# EAGLE board PSU (EAGLE 9.6.2)
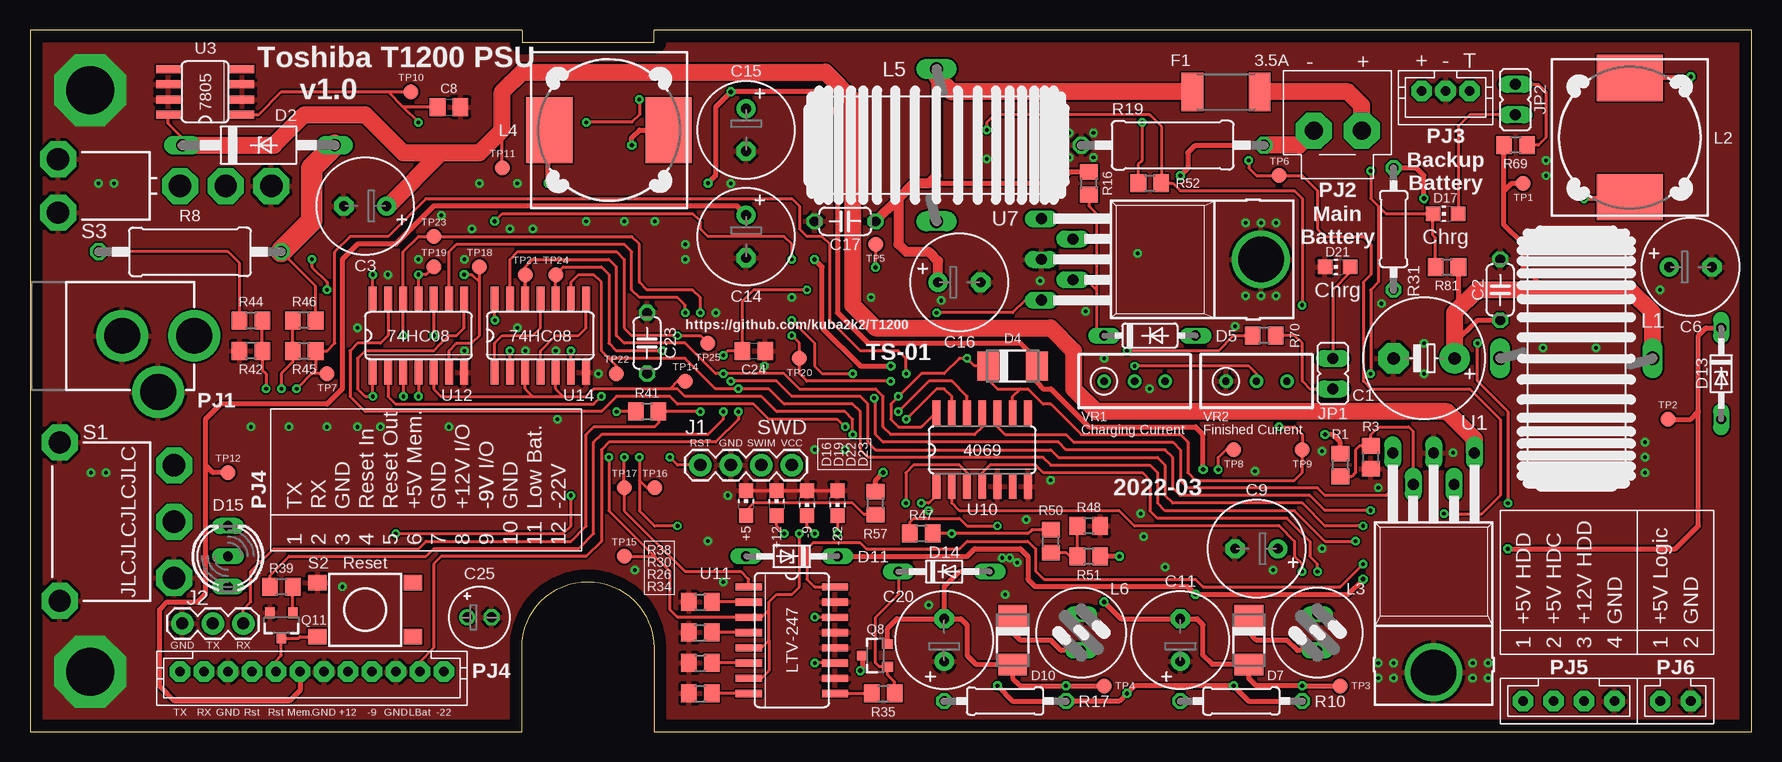
[diagram p2: board, top side]
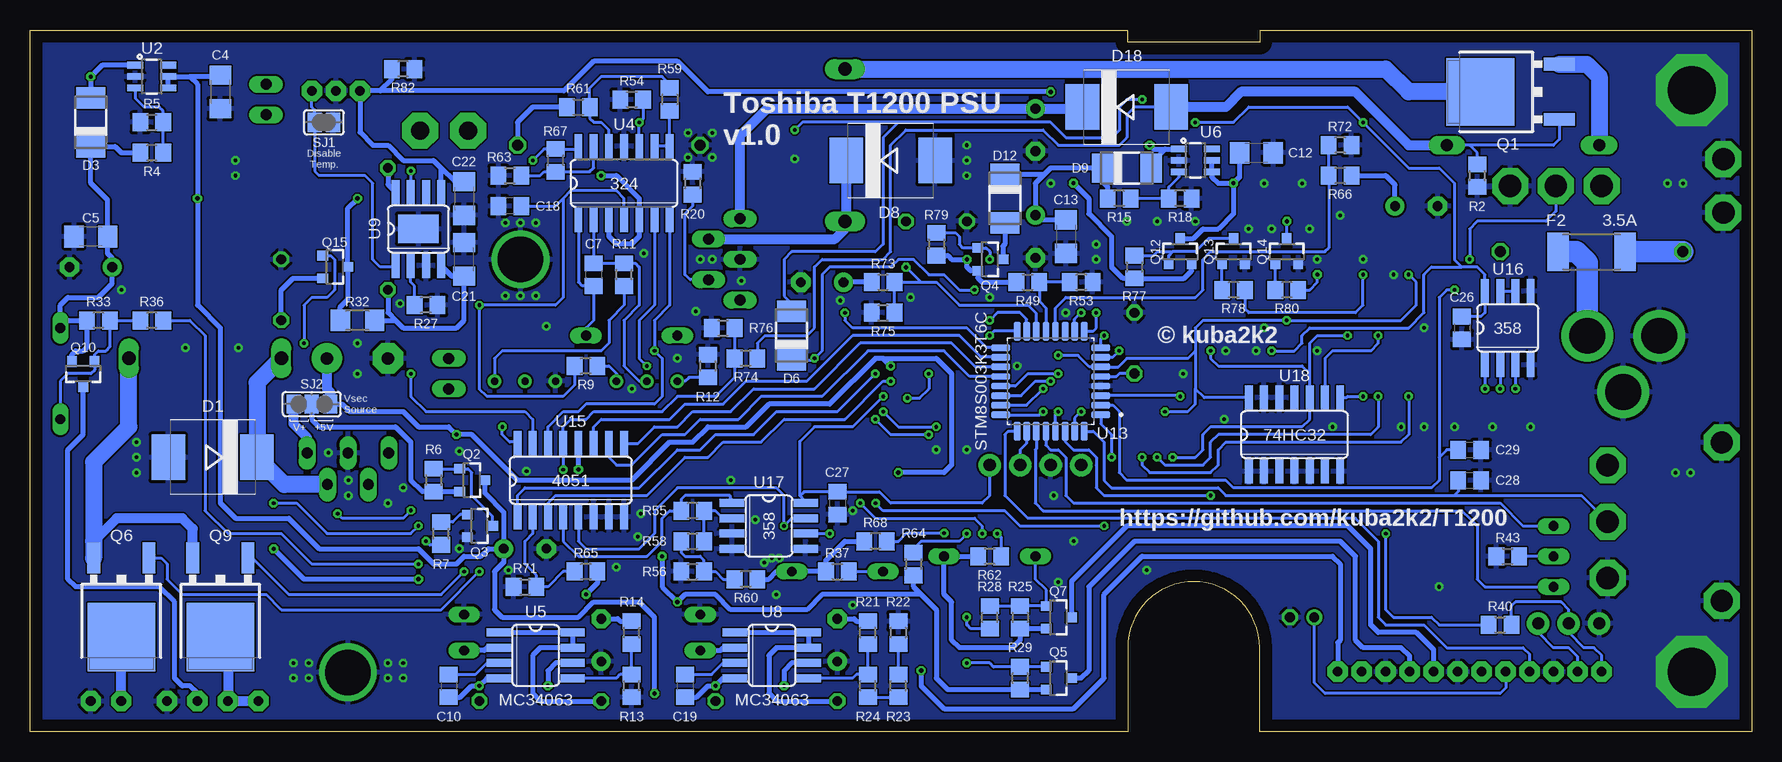
[diagram p3: board, bottom side, seen from below]

Size 143.5 x 58.5 mm. Coordinates in mm from the lower left corner, seen from the top.
Outline: 143.5,0 143.5,58.5 52,58.5 52,57.5 41,57.5 41,58.5 0,58.5 0,0 41,0 41,7 arc-180 52,7 52,0 143.5,0
Copper layers (1*16): Top 0.035mm / dielectric 1.5mm / Bottom 0.035mm
Design rules "default *": minimum track width 6mil, minimum drill 0.3mm, track to track 6mil, track to pad 6mil, pad to pad 6mil, via to via 6mil, smd to smd 6mil, copper to edge 40mil, drill to drill 6mil, minimum pad ring 10mil, minimum via ring 8mil, stop-mask expansion 4mil, vias tented up to drill 16mil, thermal gap 10mil
Net classes: 1 0.1A: width 0.254 mm, drill 0.25 mm; 2 1.2A: width 0.406 mm, drill 0.35 mm; 3 2A: width 0.813 mm, drill 0.8 mm; 4 3A: width 1.422 mm; 5 3.5A: width 1.778 mm; 6 min 1.2A: width 0.406 mm, drill 0.35 mm

## Footprints (pad centres in the part's own frame; a part is rotated, then mirrored left to right if it is on the bottom)
E5-10,5 = drill 1.016 pad 2.54: + -2.54,0 | drill 1.016 pad 2.54 octagon: - 2.54,0
C050-024X044 = drill 0.813 octagon: 1 -2.54,0; 2 2.54,0
E3,5-8 = drill 0.813 pad 1.6: + -1.778,0 | drill 0.813 pad 1.6 octagon: - 1.778,0
C1206 = smd 1.6 x 1.8: 1 -1.4,0; 2 1.4,0
C0805 = smd 1.3 x 1.5: 1 -0.95,0; 2 0.95,0
E2-5 = drill 0.813 pad 1.27: + -1.016,0 | drill 0.813 pad 1.27 octagon: - 1.016,0
SMC = smd 2.8 x 3.8: A 3.7,0; C -3.7,0
F126Z12 = drill 1.016 long: A 6.35,0; C -6.35,0
DO-214AC = smd 1.8 x 2.4: A 2.025,0; C -2.025,0
DO35-7 = drill 0.813 long: A 3.81,0; C -3.81,0
DO34Z7 = drill 0.813 long: A 3.81,0; C -3.81,0
DUOLED-C-5MM = drill 0.813 long: AR 2.54,0; AX -2.54,0; C 0,0
CHIP-LED0805 = smd 1.2 x 1.2: A 0,-1.05; C 0,1.05
2512 = smd 1.8 x 3.2: 1 -2.8,0; 2 2.8,0
1X04 = drill 1.016 pad 1.88: 1 0,0; 2 2.54,0; 3 5.08,0; 4 7.62,0
1X03 = drill 1.016 pad 1.88: 1 0,0; 2 2.54,0; 3 5.08,0
JP1 = drill 0.914 long: 1 0,-1.27; 2 0,1.27
SFT1030 = drill 1.118 long: 1 -6.35,0; 2 6.35,0
DR127 = smd 3.85 x 5.5: 1 -4.975,0; 2 4.975,0
COIL0608 = drill 0.813 long: 1 0,1.5; 2 0,-1.5
POWER_JACK_PTH = drill 2.997 pad 4.318: GND 0,7.7; GNDBREAK 4.7,10.7; PWR 0,13.7
JST-PH2-4.00 = drill 1.5 pad 3 octagon: 1 2,0; 2 -2,0
JST-PH3 = drill 0.813 pad 1.676 octagon: 1 2,0; 2 0,0; 3 -2,0
JST-PH12 = drill 0.813 pad 1.676 octagon: 1 11,0; 2 9,0; 3 7,0; 4 5,0; 5 3,0; 6 1,0; 7 -1,0; 8 -3,0; 9 -5,0; 10 -7,0; 11 -9,0; 12 -11,0
JST-PH4-2.54 = drill 0.813 pad 1.676 octagon: 1 3.81,0; 2 1.27,0; 3 -1.27,0; 4 -3.81,0
JST-PH2-2.54 = drill 0.813 pad 1.676 octagon: 1 1.27,0; 2 -1.27,0
TO-252/DPAK = smd 1.06 x 2.6: 1 -2.3,-4.31; 3 2.3,-4.31 | smd 5.632 x 5.7: 2 0,2.288
SOT23-3 = smd 0.8 x 0.9: 1 -0.95,-1; 2 0.95,-1; 3 0,1.1
R0805 = smd 1.3 x 1.5: 1 -0.95,0; 2 0.95,0
0411/15 = drill 0.914 octagon: 1 -7.62,0; 2 7.62,0
0207/10 = drill 0.813 octagon: 1 -5.08,0; 2 5.08,0
R1206 = smd 1.6 x 1.803: 1 -1.422,0; 2 1.422,0
1101M2S3ABE2 = drill 1.85 pad 3 octagon: 1 0,-4.7; 2 0,0; 3 0,4.7; S1 -9.53,-6.605; S2 -9.53,6.605
TACTILE_SWITCH_SMD_6.2MM_TALL = smd 1.55 x 1.3: A1 -3.975,-2.25; A2 3.975,-2.25; B1 -3.975,2.25; B2 3.975,2.25
1101M2S3AV2BE2 = drill 1.85 pad 3 octagon: 1 0,0; 2 3.81,0; 3 7.62,0; S1 -10.16,-2.225; S2 -10.16,2.225
SJ = smd 1.168 x 1.6: 1 -0.762,0; 2 0.762,0
SJ_2 = smd 1.168 x 1.6: 1 -1.524,0; 2 0,0; 3 1.524,0
B1,27 = smd 1.27 x 1.27: TP 0,0
TO220-52-VIAHOLE = drill 0.9 long: 1 -3.4,-21.1; 2 -1.7,-18.47; 3 0,-21.1; 4 1.7,-18.47; 5 3.4,-21.1 | drill 3.8: TAB 0,-2.8
SOT23-6 = smd 0.55 x 1.35: 1 -0.95,-1.375; 2 0,-1.375; 3 0.95,-1.375; 4 0.95,1.375; 5 0,1.375; 6 -0.95,1.375
SO08 = smd 0.66 x 2.032: 1 -1.905,-3.073; 2 -0.635,-3.073; 3 0.635,-3.073; 4 1.905,-3.073; 5 1.905,3.073; 6 0.635,3.073; 7 -0.635,3.073; 8 -1.905,3.073
SO14 = smd 0.66 x 2.032: 1 -3.81,-3.073; 2 -2.54,-3.073; 3 -1.27,-3.073; 4 0,-3.073; 5 1.27,-3.073; 6 2.54,-3.073; 7 3.81,-3.073; 8 3.81,3.073; 9 2.54,3.073; 10 1.27,3.073; 11 0,3.073; 12 -1.27,3.073; 13 -2.54,3.073; 14 -3.81,3.073
SO08-PAD = smd 0.66 x 2.032: 1 -1.905,-3.073; 2 -0.635,-3.073; 3 0.635,-3.073; 4 1.905,-3.073; 5 1.905,3.073; 6 0.635,3.073; 7 -0.635,3.073; 8 -1.905,3.073 | smd 3.4 x 2.4: PAD 0,0
SO16-GULLWING = smd 0.6 x 2.2: 1 -4.445,-3.6; 2 -3.175,-3.6; 3 -1.905,-3.6; 4 -0.635,-3.6; 5 0.635,-3.6; 6 1.905,-3.6; 7 3.175,-3.6; 8 4.445,-3.6; 9 4.445,3.6; 10 3.175,3.6; 11 1.905,3.6; 12 0.635,3.6; 13 -0.635,3.6; 14 -1.905,3.6; 15 -3.175,3.6; 16 -4.445,3.6
QFP80P900X900X160-32N = smd 1.56 x 0.55: 1 -4.18,2.8; 2 -4.18,2; 3 -4.18,1.2; 4 -4.18,0.4; 5 -4.18,-0.4; 6 -4.18,-1.2; 7 -4.18,-2; 8 -4.18,-2.8; 17 4.18,-2.8; 18 4.18,-2; 19 4.18,-1.2; 20 4.18,-0.4; 21 4.18,0.4; 22 4.18,1.2; 23 4.18,2; 24 4.18,2.8 | smd 0.55 x 1.56: 9 -2.8,-4.18; 10 -2,-4.18; 11 -1.2,-4.18; 12 -0.4,-4.18; 13 0.4,-4.18; 14 1.2,-4.18; 15 2,-4.18; 16 2.8,-4.18; 25 2.8,4.18; 26 2,4.18; 27 1.2,4.18; 28 0.4,4.18; 29 -0.4,4.18; 30 -1.2,4.18; 31 -2,4.18; 32 -2.8,4.18
SO16 = smd 0.66 x 2.032: 1 -4.445,-3.073; 2 -3.175,-3.073; 3 -1.905,-3.073; 4 -0.635,-3.073; 5 0.635,-3.073; 6 1.905,-3.073; 7 3.175,-3.073; 8 4.445,-3.073; 9 4.445,3.073; 10 3.175,3.073; 11 1.905,3.073; 12 0.635,3.073; 13 -0.635,3.073; 14 -1.905,3.073; 15 -3.175,3.073; 16 -4.445,3.073
RTRIM3296W = drill 0.61: 1 0,-2.54; 2 0,0; 3 0,2.54

## Placement (x,y rotation side)
C1  1000u  [E5-10,5]  116.2,31.11 180 top
C2  1u  [C050-024X044]  122.56,36.83 90 top
C3  470u  [E3,5-8]  27.94,43.81 180 top
C4  10u  [C1206]  127.64,53.34 270 bottom
C5  10u  [C1206]  138.43,41.27 180 bottom
C6  100u  [E3,5-8]  138.43,38.73 0 top
C7  100n  [C0805]  96.52,38.1 270 bottom
C8  100n  [C0805]  34.92,52.07 0 top
C9  100u  [E3,5-8]  102.23,15.24 180 top
C10  1n  [C0805]  108.58,3.81 270 bottom
C11  100u  [E3,5-8]  95.89,7.62 90 top
C12  10u  [C1206]  41.27,48.26 0 bottom
C13  10u  [C1206]  57.15,41.27 270 bottom
C14  100u  [E3,5-8]  59.69,41.27 270 top
C15  470u  [E3,5-8]  59.69,50.16 270 top
C16  470u  [E3,5-8]  77.47,37.47 0 top
C17  1u  [C050-024X044]  67.94,42.55 180 top
C18  100n  [C0805]  103.5,43.81 180 bottom
C19  1n  [C0805]  88.9,3.81 270 bottom
C20  100u  [E3,5-8]  76.2,7.62 90 top
C21  10u  [C1206]  107.31,39.37 90 bottom
C22  10u  [C1206]  107.31,44.45 270 bottom
C23  1u  [C050-024X044]  51.44,32.38 90 top
C24  100n  [C0805]  60.33,31.75 0 top
C25  10u  [E2-5]  37.47,9.53 0 top
C26  100n  [C0805]  24.13,33.66 270 bottom
C27  100n  [C0805]  76.2,19.05 270 bottom
C28  100n  [C0805]  23.5,20.95 0 bottom
C29  100n  [C0805]  23.5,23.5 0 bottom
D1  SS34  [SMC]  128.27,22.86 180 bottom
D2  1N5822  [F126Z12]  19.05,48.9 0 top
D3  SS14  [DO-214AC]  138.43,50.8 90 bottom
D4  SS14  [DO-214AC]  81.92,30.48 0 top
D5  1N4148  [DO35-7]  93.34,33.02 0 top
D6  SS14  [DO-214AC]  80.01,33.02 90 bottom
D7  SS14  [DO-214AC]  101.6,7.62 270 top
D8  SS34  [SMC]  71.75,47.62 0 bottom
D9  SS14  [DO-214AC]  52.07,46.99 0 bottom
D10  SS14  [DO-214AC]  81.92,7.62 270 top
D11  Z9.1V  [DO34Z7]  63.5,14.61 180 top
D12  SS14  [DO-214AC]  62.23,44.45 270 bottom
D13  Z9.1V  [DO34Z7]  140.97,29.84 270 top
D14  Z9.1V  [DO34Z7]  76.2,13.34 0 top
D15  DUO_RG_C  [DUOLED-C-5MM]  16.51,14.61 90 top
D16  GREEN  [CHIP-LED0805]  59.69,19.05 0 top
D17  YELLOW  [CHIP-LED0805]  118,43.18 90 top
D18  SS34  [SMC]  52.07,52.07 0 bottom
D19  GREEN  [CHIP-LED0805]  62.23,19.05 0 top
D21  YELLOW  [CHIP-LED0805]  109,38.73 90 top
D22  RED  [CHIP-LED0805]  64.77,19.05 180 top
D23  RED  [CHIP-LED0805]  67.31,19.05 180 top
F1  3.5A  [2512]  99.69,53.34 0 top
F2  3.5A  [2512]  13.34,40.01 0 bottom
J1  SWD  [1X04]  63.5,22.23 180 top
J2  UART  [1X03]  12.7,9.02 0 top
JP1  LedChg  [JP1]  108.58,29.84 0 top
JP2  LedBChg  [JP1]  123.83,52.7 180 top
L1  68u  [SFT1030]  128.91,31.11 0 top
L2  22u  [DR127]  133.35,49.53 90 top
L3  470u  [COIL0608]  107.31,8.26 180 top
L4  22u  [DR127]  48.26,50.16 0 top
L5  220u  [SFT1030]  75.56,48.9 90 top
L6  470u  [COIL0608]  87.63,8.26 180 top
PJ1  PowerIn  [POWER_JACK_PTH]  0,33 270 top
PJ2  BatMain  [JST-PH2-4.00]  109,50.12 0 top
PJ3  BatBackup  [JST-PH3]  118,53.42 180 top
PJ4  MB  [JST-PH12]  23.5,5 180 top
PJ5  HDD  [JST-PH4-2.54]  128.27,2.54 180 top
PJ6  Logic  [JST-PH2-2.54]  137.16,2.54 180 top
Q1  PMOS-DPAK  [TO-252/DPAK]  20.32,53.34 90 bottom
Q2  PMOS-SOT23  [SOT23-3]  106.68,20.95 270 bottom
Q3  NPN  [SOT23-3]  106.05,17.14 270 bottom
Q4  PMOS-SOT23  [SOT23-3]  63.5,39.37 270 bottom
Q5  NMOS-SOT23  [SOT23-3]  57.78,4.45 270 bottom
Q6  PMOS-DPAK  [TO-252/DPAK]  135.89,10.16 180 bottom
Q7  PMOS-SOT23  [SOT23-3]  57.78,9.53 270 bottom
Q8  NMOS-SOT23  [SOT23-3]  70.48,6.35 90 top
Q9  PMOS-DPAK  [TO-252/DPAK]  127.64,10.16 180 bottom
Q10  PMOS-SOT23  [SOT23-3]  139.06,29.84 180 bottom
Q11  NPN  [SOT23-3]  20.95,8.89 180 top
Q12  PMOS-SOT23  [SOT23-3]  47.62,40.01 0 bottom
Q13  NPN  [SOT23-3]  43.18,40.01 0 bottom
Q14  NPN  [SOT23-3]  38.73,40.01 0 bottom
Q15  PMOS-SOT23  [SOT23-3]  118.11,38.73 270 bottom
R1  47k  [R0805]  109.22,22.23 90 top
R2  10k  [R0805]  22.86,46.35 90 bottom
R3  15k  [R0805]  111.76,22.86 90 top
R4  4.7k  [R0805]  133.35,48.26 180 bottom
R5  240  [R0805]  133.35,50.8 0 bottom
R6  10k  [R0805]  109.86,20.95 270 bottom
R7  10k  [R0805]  109.22,16.51 90 bottom
R8  0.1  [0411/15]  13.34,40.01 0 top
R9  220k  [R0805]  97.16,30.48 180 bottom
R10  1.5  [0207/10]  100.97,2.54 180 top
R11  100k  [R0805]  93.98,38.1 90 bottom
R12  330  [R0805]  87,30.48 270 bottom
R13  22k  [R0805]  93.34,3.81 90 bottom
R14  3.3k  [R0805]  93.34,8.26 90 bottom
R15  33k  [R0805]  52.7,44.45 180 bottom
R16  22k  [R0805]  88.27,45.72 90 top
R17  1.5  [0207/10]  81.28,2.54 180 top
R18  4.7k  [R0805]  47.62,44.45 180 bottom
R19  0.1  [0411/15]  95.25,48.9 0 top
R20  3.9k  [R0805]  88.27,45.72 270 bottom
R21  4.7k  [R0805]  73.66,8.26 90 bottom
R22  10k  [R0805]  71.12,8.26 270 bottom
R23  33k  [R0805]  71.12,3.81 90 bottom
R24  33k  [R0805]  73.66,3.81 90 bottom
R25  10k  [R0805]  60.96,9.53 270 bottom
R26  10k  [R0805]  55.88,5.71 0 top
R27  5k  [R0805]  110.49,35.56 180 bottom
R28  10k  [R0805]  63.5,9.53 90 bottom
R29  10k  [R0805]  60.96,4.45 90 bottom
R30  10k  [R0805]  55.88,8.26 0 top
R31  0.4  [0207/10]  113.67,41.91 270 top
R32  0.4  [R1206]  116.2,34.29 0 bottom
R33  10k  [R0805]  137.79,34.29 180 bottom
R34  10k  [R0805]  55.88,3.17 0 top
R35  10k  [R0805]  71.12,3.17 0 top
R36  10k  [R0805]  133.35,34.29 180 bottom
R37  10k  [R0805]  76.2,13.34 0 bottom
R38  10k  [R0805]  55.88,10.79 0 top
R39  10k  [R0805]  20.95,12.06 180 top
R40  10k  [R0805]  20.95,8.89 0 bottom
R41  10k  [R0805]  51.44,26.67 180 top
R42  10k  [R0805]  18.41,31.75 180 top
R43  220  [R0805]  20.32,14.61 0 bottom
R44  10k  [R0805]  18.41,34.29 0 top
R45  10k  [R0805]  22.86,34.29 180 top
R46  10k  [R0805]  22.86,31.75 0 top
R47  10k  [R0805]  74.3,16.51 180 top
R48  10k  [R0805]  88.27,17.14 180 top
R49  10k  [R0805]  60.33,37.47 0 bottom
R50  10k  [R0805]  85.09,15.88 90 top
R51  20k  [R0805]  88.27,14.61 180 top
R52  33k  [R0805]  93.34,45.72 0 top
R53  10k  [R0805]  55.88,37.47 180 bottom
R54  22k  [R0805]  93.34,52.7 0 bottom
R55  20k  [R0805]  88.27,18.41 180 bottom
R56  10k  [R0805]  88.27,13.34 0 bottom
R57  1k  [R0805]  70.48,19.05 90 top
R58  10k  [R0805]  88.27,15.88 0 bottom
R59  47k  [R0805]  90.17,52.7 270 bottom
R60  100k  [R0805]  83.82,12.7 180 bottom
R61  10k  [R0805]  97.79,52.07 0 bottom
R62  3.3k  [R0805]  63.5,14.61 180 bottom
R63  10k  [R0805]  103.5,46.35 0 bottom
R64  9.1k  [R0805]  69.85,13.97 270 bottom
R65  20k  [R0805]  97.16,13.34 180 bottom
R66  20k  [R0805]  34.29,46.35 180 bottom
R67  47k  [R0805]  99.69,47.62 90 bottom
R68  30k  [R0805]  73.03,15.88 180 bottom
R69  1k  [R0805]  123.83,48.9 180 top
R70  1k  [R0805]  102.87,33.02 180 top
R71  10k  [R0805]  102.23,12.06 0 bottom
R72  10k  [R0805]  34.29,48.9 180 bottom
R73  10k  [R0805]  72.39,37.47 0 bottom
R74  20k  [R0805]  83.82,31.11 180 bottom
R75  10k  [R0805]  72.39,34.92 0 bottom
R76  10k  [R0805]  85.72,33.66 0 bottom
R77  100k  [R0805]  51.44,38.73 270 bottom
R78  10k  [R0805]  43.18,36.83 180 bottom
R79  100k  [R0805]  67.94,40.64 270 bottom
R80  10k  [R0805]  38.73,36.83 180 bottom
R81  10k  [R0805]  118.11,38.73 0 top
R82  100k  [R0805]  112.39,55.24 180 bottom
S1  1101M2S3ABE2  [1101M2S3ABE2]  12,17.5 0 top
S2  Reset  [TACTILE_SWITCH_SMD_6.2MM_TALL]  27.94,10.16 180 top
S3  1101M2S3AV2BE2  [1101M2S3AV2BE2]  12.5,45.5 0 top
SJ1  VbTempEn  [SJ]  119,50.8 0 bottom
SJ2  SecVinSrc  [SJ_2]  120.02,27.3 0 bottom
TP1  TPB1,27  [B1,27]  124.46,45.72 0 top
TP2  TPB1,27  [B1,27]  136.53,26.04 0 top
TP3  TPB1,27  [B1,27]  109.22,3.81 0 top
TP4  TPB1,27  [B1,27]  89.53,3.81 0 top
TP5  TPB1,27  [B1,27]  70.48,40.64 0 top
TP6  TPB1,27  [B1,27]  104.14,46.35 0 top
TP7  TPB1,27  [B1,27]  24.77,29.84 0 top
TP8  TPB1,27  [B1,27]  100.33,23.5 0 top
TP9  TPB1,27  [B1,27]  106.05,23.5 0 top
TP10  TPB1,27  [B1,27]  31.75,53.34 0 top
TP11  TPB1,27  [B1,27]  39.37,46.99 0 top
TP12  TPB1,27  [B1,27]  16.51,21.59 0 top
TP14  TPB1,27  [B1,27]  54.61,29.21 0 top
TP15  TPB1,27  [B1,27]  49.53,14.61 0 top
TP16  TPB1,27  [B1,27]  52.07,20.32 0 top
TP17  TPB1,27  [B1,27]  49.53,20.32 0 top
TP18  TPB1,27  [B1,27]  37.47,38.73 0 top
TP19  TPB1,27  [B1,27]  33.66,38.73 0 top
TP20  TPB1,27  [B1,27]  64.14,31.11 0 top
TP21  TPB1,27  [B1,27]  41.27,38.1 0 top
TP22  TPB1,27  [B1,27]  48.9,29.84 0 top
TP23  TPB1,27  [B1,27]  33.66,41.27 0 top
TP24  TPB1,27  [B1,27]  43.81,38.1 0 top
TP25  TPB1,27  [B1,27]  56.52,32.38 0 top
U1  LM2576  [TO220-52-VIAHOLE]  117,2.13 180 top
U2  MT3608  [SOT23-6]  133.35,54.61 270 bottom
U3  7805  [SO08]  14.61,53.34 90 top
U4  324  [SO14]  93.98,45.72 0 bottom
U5  MC34063  [SO08]  101.35,6.35 270 bottom
U6  MT3608  [SOT23-6]  46.35,47.62 270 bottom
U7  LM2576  [TO220-52-VIAHOLE]  105.41,39.37 270 top
U8  MC34063  [SO08]  81.66,6.35 270 bottom
U9  TP4056  [SO08-PAD]  111.12,41.91 0 bottom
U10  4069  [SO14]  79.38,23.5 0 top
U11  LTV-247  [SO16-GULLWING]  63.5,7.62 270 top
U12  74HC08  [SO14]  32.38,33.02 0 top
U13  STM8S003K3T6C  [QFP80P900X900X160-32N]  58.42,29.21 180 bottom
U14  74HC08  [SO14]  42.55,33.02 0 top
U15  4051  [SO16]  98.42,20.95 0 bottom
U16  358  [SO08]  20.32,33.66 0 bottom
U17  358  [SO08]  81.92,17.14 270 bottom
U18  74HC32  [SO14]  38.1,24.77 0 bottom
VR1  10k  [RTRIM3296W]  92.08,29.21 270 top
VR2  100k  [RTRIM3296W]  102.23,29.21 270 top

## Tracks (layer width: path | path; a pad name or v marks a point on that pad's centre or on a via)
+5V  (via drill 0.35, 0.35 pad 0.55)
  Top 0.406: 126.36,36.83 124.46,38.73 124.46,40.64 122.87,42.23 122.87,45.08 | C2.1 120.65,34.29 118.75,32.38 | TP1.TP 123.51,45.72 122.87,45.08 | 122.87,45.08 R69.2 | v65.41,39.37 66.04,38.73 66.04,33.66 69.22,30.48 v71.75,30.48 | R57.2 70.48,20.95 v71.12,21.59 | R1.2 109.22,24.13 108.58,24.77 v107.95,24.77 | R81.2 119.06,35.24 118.75,34.92
  Top 1.422: L1.2 135.25,34.92 133.35,36.83 126.36,36.83 120.65,36.83 118.75,34.92 118.75,32.38 C1.+
  Bottom 0.406: SJ2.3 117.47,27.3 116.84,26.67 112.39,26.67 111.12,25.4 108.58,25.4 v107.95,24.77 106.68,24.77 102.87,20.95 93.34,20.95 90.17,24.13 88.27,24.13 87,25.4 83.82,25.4 81.92,27.3 76.83,27.3 73.03,31.11 72.39,31.11 | R49.1 64.14,37.47 64.5,37.83 Q4.2 65.09,38.42 65.41,38.73 v65.41,39.37 66.67,39.37 67,39.69 R79.2 | 72.39,31.11 67.94,31.11 66.67,29.84 66.67,22.23 67.31,21.59 v71.12,21.59 | v71.75,30.48 72.39,31.11 | Q15.2 121.6,37.78 122.56,36.83 C2.1
  Bottom 0.813: Q9.3 129.94,16.91 130.81,17.78 136.28,17.78 138.19,15.88 | SJ2.3 118.49,28.32 118.75,28.57 C1.+
  Bottom 1.422: L1.2 135.25,25.4 138.19,22.46 138.19,15.88 Q6.3
+5V_HDD
  Bottom 0.813: PJ5.1 PJ5.2 127,7.24 Q9.2
+5V_LOGIC
  Bottom 0.813: PJ6.1 Q6.2
+5V_MEM
  Top 0.406: C14.+ 58.93,43.81 33.66,43.81 30.48,40.64 27.3,40.64 26.04,39.37 26.04,28.57 24.77,27.3 15.88,27.3 14.61,26.04 14.61,22.23 | 14.61,22.23 14.61,11.43 13.97,10.79 11.43,10.79 10.79,10.16 10.79,3.81 12.06,2.54 21.59,2.54 22.5,3.45 PJ4.6 | TP12.TP 15.24,21.59 14.61,22.23
  Bottom 0.406: R15.2 53.66,45.4 54.09,45.84 D9.C 58.42,46.99 58.94,46.48 | 58.94,46.48 59.69,45.72 C14.+ 59.31,42.67 C13.1 | D12.C 58.94,46.48
+5VHDD_G  (via drill 0.3)
  Top 0.254: v107.31,13.34 107.31,13.97 106.68,14.61 106.68,15.88 104.78,17.78 93.98,17.78 93.34,18.41 93.34,20.95 92.71,21.59 84.45,21.59 83.82,22.23 80.01,22.23 79.38,21.59 U10.4
  Bottom 0.254: Q9.1 124.96,14.47 121.92,11.43 109.22,11.43 v107.31,13.34
+5VLOG_G  (via drill 0.3)
  Top 0.254: v106.05,13.34 106.05,13.97 105.41,14.61 105.41,15.88 104.14,17.14 92.08,17.14 90.81,18.41 77.47,18.41 76.83,19.05 U10.2
  Bottom 0.254: Q6.1 132.58,14.47 132.08,13.97 132.08,12.7 130.81,11.43 123.83,11.43 122.56,10.16 109.22,10.16 v106.05,13.34
+5VMEM_B
  Bottom 0.254: R80.2 Q14.1
+5VMEM_D
  Bottom 0.406: D12.A 62.23,40.64 62.4,40.47 Q4.3
+5VMEM_G  (via drill 0.3, 0.35)
  Top 0.254: v63.5,39.37 63.5,40.64 62.87,41.27 56.52,41.27 55.88,41.91 55.88,42.55 55.24,43.18 39.37,43.18 v38.73,42.55
  Bottom 0.254: v63.5,39.37 63.5,40.01 63.81,40.32 Q4.1 65.72,40.32 66.04,40.64 66.04,41.27 66.36,41.59 R79.1 | Q14.3 v38.73,42.55
+12V  (via drill 0.35)
  Top 0.406: v111.12,12.7 109.86,11.43 v97.16,11.43 96.52,12.06 83.82,12.06 83.19,12.7 83.19,14.61 82.55,15.24 78.74,15.24 78.11,14.61 D11.C | v123.19,15.24 137.16,15.24 139.06,17.14 139.06,26.67 | 139.06,26.67 139.06,33.02 139.7,33.66 D13.C | 139.06,26.67 138.43,26.04 TP2.TP
  Bottom 0.406: v111.12,12.7 120.65,12.7 v123.19,15.24 | R4.2 135.89,48.26 136.41,48.77 D3.C 138.43,45.72 137.03,44.32 C5.1 137.03,39.88 136.65,39.5 C6.+ 136.65,37.34 137.79,36.2 140.34,36.2 140.97,35.56 D13.C 140.34,34.29 R33.2 138.75,32.07 139.06,31.75 139.7,31.75 140.01,31.43 Q10.2 | Q7.2 R25.2 60.96,7.62 61.59,6.99 66.04,6.99 66.67,7.62 66.67,10.79 67.31,11.43 D11.C R62.2 | R65.1 96.2,12.38 v97.16,11.43
+12V_FB
  Bottom 0.254: R4.1 R5.2 132.4,51.76 132.72,52.07 133.99,52.07 134.72,52.81 U2.3
+12V_HDD
  Bottom 0.406: PJ5.3 129.54,3.17 130.18,3.81 130.81,3.81 131.44,4.45 131.44,10.79 132.72,12.06 139.7,12.06 140.34,12.7 140.34,23.5 139.06,24.77 Q10.3
+12V_IO
  Bottom 0.406: PJ4.8 26.5,6.82 27.94,8.26 31.11,8.26 31.75,8.89 31.75,15.24 33.66,17.14 52.07,17.14 56.69,12.53 Q7.3
+12V_SW  (via drill 0.35)
  Top 0.406: v138.43,54.61 138.32,54.51 L2.2
  Bottom 0.406: U2.1 137.48,55.56 v138.43,54.61 D3.A
+12VHDD_C  (via drill 0.3)
  Top 0.254: U11.16 65.41,12.06 64.77,12.7 64.77,15.24 65.28,15.75 69.22,15.75 69.72,15.24 77.47,15.24 78.11,15.88 83.19,15.88 83.82,15.24 83.82,13.38 84.5,12.7 97.16,12.7 97.79,12.06 109.22,12.06 v111.12,13.97
  Bottom 0.254: R36.1 130.18,34.29 128.91,33.02 128.91,18.41 127,16.51 122.56,16.51 120.02,13.97 v111.12,13.97
+12VHDD_G
  Bottom 0.254: D13.A 140.97,29.21 140.34,29.84 138.43,29.84 138.12,30.16 Q10.1 138.12,31.43 137.79,31.75 137.16,31.75 136.84,32.06 R33.1 R36.2
+12VHDD_N
  Top 0.254: U11.2 R38.2
+12VIO_C  (via drill 0.3)
  Top 0.254: U11.14 v65.41,9.53
  Bottom 0.254: R28.1 65.09,8.57 65.41,8.89 v65.41,9.53
+12VIO_G
  Bottom 0.254: R28.2 R25.1 Q7.1 58.78,11.79 59.69,12.7 D11.A
+12VIO_N
  Top 0.254: U11.4 R30.2
-9V  (via drill 0.35)
  Top 0.406: v90.81,14.61 R51.1 | TP3.TP v106.05,3.81 102.23,3.81 101.6,4.45 D7.A 98.55,5.59 97.79,6.35 97.79,8.89 97.28,9.4 C11.- 90.93,9.4 v89.53,10.79
  Bottom 0.406: C10.2 107.63,2.86 106.68,3.81 v106.05,3.81 105.41,4.45 U5.4 | v90.81,14.61 90.81,12.06 v89.53,10.79 88.9,11.43 86.36,11.43 85.09,10.16 78.74,10.16 77.47,11.43 69.22,11.43 | 69.22,11.43 69.85,12.06 R64.2 | 69.22,11.43 67.94,10.16 67.94,4.45 67,3.5 R29.1 Q5.2 | R14.2 94.3,9.21 94.49,9.4 C11.-
-9V_COMP
  Bottom 0.254: U5.5 94.61,4.45 94.3,4.76 R13.2 R14.1
-9V_IO
  Bottom 0.406: PJ4.9 28.5,6.28 29.21,6.99 32.38,6.99 33.02,7.62 33.02,14.61 34.29,15.88 51.44,15.88 55.24,12.06 55.24,5.08 55.88,4.45 Q5.3
-9V_SWC
  Bottom 0.406: U5.1 U5.8 U5.7 100.97,6.99 101.6,6.35 101.6,3.17 100.97,2.54 R10.2
-9V_SWE
  Top 0.406: L3.1 105.64,6.75 104.78,7.62 102.23,7.62 101.6,8.26 D7.C
  Bottom 0.406: U5.2 105.41,6.99 105.64,6.75 L3.1
-9V_TC
  Bottom 0.254: U5.3 105.41,5.71 106.36,4.76 C10.1
-9VIO_G  (via drill 0.3)
  Top 0.254: U11.11 v65.41,5.71
  Bottom 0.254: v65.41,5.71 63.5,5.71 63.18,5.39 R29.2 Q5.1
-9VIO_N
  Top 0.254: U11.6 R26.2
-22V  (via drill 0.35)
  Top 0.406: D14.A 77.47,13.34 76.2,12.06 C20.- | C20.- 77.6,9.4 78.11,8.89 78.11,6.35 78.86,5.59 D10.A 81.92,4.45 82.55,3.81 v86.36,3.81 TP4.TP | Q8.2 71.48,8.62 72.26,9.4 C20.-
  Bottom 0.406: C19.2 87.94,2.86 87,3.81 v86.36,3.81 85.72,4.45 U8.4 | R21.2 74.61,9.21 74.8,9.4 C20.- | R68.2 75.56,15.88 77.15,14.29 R37.1 D14.A 81.28,13.34 81.92,12.7 R60.1
-22V_COMP1
  Bottom 0.254: U8.5 74.93,4.45 74.61,4.76 R24.2 R21.1
-22V_COMP2
  Bottom 0.254: R24.1 R23.1
-22V_COMP3
  Bottom 0.254: R23.2 R22.2
-22V_LCD  (via drill 0.35)
  Top 0.406: Q8.3 69.39,5.25 v69.22,5.08
  Bottom 0.406: v69.22,5.08 69.22,3.81 67.31,1.91 56.52,1.91 53.98,4.45 53.98,11.43 50.8,14.61 34.92,14.61 34.29,13.97 34.29,7.62 34.5,7.41 PJ4.12
-22V_SWC
  Bottom 0.406: U8.1 U8.8 U8.7 81.28,6.99 81.92,6.35 81.92,3.17 81.28,2.54 R17.2
-22V_SWE
  Top 0.406: L6.1 85.95,6.75 85.09,7.62 82.55,7.62 81.92,8.26 D10.C
  Bottom 0.406: L6.1 85.95,6.75 85.72,6.99 U8.2
-22V_TC
  Bottom 0.254: U8.3 85.72,5.71 86.68,4.76 C19.1
-22VLCD_E
  Top 0.254: U11.9 R35.1
-22VLCD_G
  Top 0.254: R35.2 72.07,4.13 71.48,4.71 Q8.1 70.8,5.4 70.48,5.71 70.48,9.53 72.39,11.43 D14.C
  Bottom 0.254: R37.2 D14.C
-22VLCD_N
  Top 0.254: U11.8 R34.2
^CHG_CTRL  (via drill 0.3)
  Top 0.254: U7.5 82.96,35.97 81.92,34.92 v75.56,34.92
  Bottom 0.254: v75.56,34.92 75.56,34.29 74.93,33.66 65.41,33.66 63.76,32.01 U13.17
^HDDON  (via drill 0.3)
  Top 0.254: v23.5,39.37 23.5,38.73 24.77,37.47 v24.77,36.83
  Bottom 0.254: S3.2 16.31,43.38 17.14,42.55 22.86,42.55 23.5,41.91 v23.5,39.37 | v24.77,36.83 25.4,36.83 26.04,36.2 26.04,22.86 | 26.04,22.86 26.04,20.95 26.67,20.32 43.18,20.32 43.81,20.95 52.07,20.95 52.7,21.59 52.7,26.67 53.24,27.21 U13.2 | C29.1 25.4,23.5 26.04,22.86
^PRI_CTRL
  Top 0.254: U1.5 113.6,20.25 113.03,19.68 107.95,19.68 107.31,20.32 96.52,20.32 95.89,20.95 95.89,23.5 95.25,24.13 87,24.13 86.36,24.77 81.28,24.77 80.64,25.4 U10.10
^PWRON
  Bottom 0.254: S1.2 13.55,19.05 14.19,19.68 24.77,19.68 | U13.32 54.88,25.03 53.98,24.13 53.98,20.95 53.34,20.32 44.45,20.32 43.81,19.68 30.48,19.68 24.77,19.68 | C28.1 24.45,20 24.77,19.68
AIN9DIV
  Top 0.254: R48.2 R51.2 86.68,14.61 86.36,14.93 R50.1
AIN9N  (via drill 0.3)
  Top 0.254: R47.1 v76.83,16.51 83.19,16.51 83.5,16.82 R50.2
  Bottom 0.254: U17.6 v76.83,16.51
AIN22DIV
  Bottom 0.254: R58.1 89.22,14.92 88.9,14.61 87.63,14.61 87.31,14.29 R56.2 86.36,13.34 85.72,12.7 R60.2
AIN22N
  Bottom 0.254: R58.2 R55.1 86.36,18.41 85.72,17.78 U17.2
AIN_+5V
  Bottom 0.254: R53.2 R49.2 59.38,35.88 58.82,35.33 U13.13
AIN_+12V
  Bottom 0.254: U15.2 101.6,16.51 102.23,15.88 102.23,13.97 101.28,13.02 R71.2 100.33,12.06 99.06,13.34 R65.2
AIN_-9V  (via drill 0.3)
  Top 0.254: R47.2 73.34,17.46 73.66,17.78 77.47,17.78 78.11,17.14 v80.64,17.14
  Bottom 0.254: U15.5 97.79,15.88 97.16,15.24 92.71,15.24 91.44,16.51 91.44,18.41 89.53,20.32 81.28,20.32 80.64,19.68 v80.64,17.14 80.01,17.78 U17.7
AIN_-22V
  Bottom 0.254: U15.4 99.06,15.88 97.79,14.61 92.08,14.61 90.81,15.88 90.81,17.78 90.17,18.41 R55.2 89.22,19.37 88.9,19.68 85.15,19.68 U17.1
AIN_IBAT  (via drill 0.3)
  Top 0.254: v101.6,47.62 101.6,46.99 102.23,46.35 TP6.TP 106.05,46.35 107.31,45.09 107.31,41.91 107.95,41.27 111.12,41.27 111.76,40.64 111.76,38.1 111.12,37.47 111.12,29.21 111.76,28.57 120.02,28.57 122.56,26.04 122.56,19.68 121.03,18.16 v117.86,18.16 | v111.76,18.44 107.93,18.44 106.68,19.68 95.89,19.68 95.25,20.32 95.25,22.86 94.61,23.5 86.36,23.5 85.72,24.13 71.12,24.13 70.48,24.77 70.48,27.68 v70.36,27.81 | v63.5,34.29 65.41,32.38 65.41,30.48 66.04,29.84 v68.58,29.84 | v117.86,18.16 | v117.86,18.16
  Bottom 0.254: U4.14 98.05,48.58 R67.2 100.65,48.58 v101.6,47.62 | v111.76,18.44 111.76,18.41 112.39,17.78 117.47,17.78 v117.86,18.16 | v63.5,34.29 62.87,34.92 60.96,34.92 60.42,34.38 U13.15 | v70.36,27.81 69.34,27.81 68.58,28.57 v68.58,29.84
AIN_IBUS  (via drill 0.3)
  Top 0.254: 23.5,29.84 23.81,30.16 R46.2 24.77,31.75 25.4,32.38 25.4,40.01 26.67,41.27 29.84,41.27 33.02,44.45 63.5,44.45 64.14,43.81 64.14,41.91 64.77,41.27 66.04,41.27 66.67,40.64 66.67,34.29 69.22,31.75 72.39,31.75 73.03,31.11 v73.03,29.84 | 23.5,29.84 v22.23,28.57 | TP7.TP 23.5,29.84
  Bottom 0.254: U16.1 v22.23,28.57 | U15.1 102.87,19.68 102.23,20.32 92.71,20.32 89.53,23.5 87.63,23.5 86.36,24.77 83.19,24.77 81.28,26.67 76.2,26.67 v73.03,29.84
AIN_MULTI  (via drill 0.3)
  Top 0.254: v71.75,29.21 64.77,29.21 64.14,29.84 TP20.TP 64.14,32.38 v63.5,33.02
  Bottom 0.254: U15.3 100.33,19.05 99.69,19.68 92.08,19.68 88.9,22.86 87,22.86 85.72,24.13 82.55,24.13 80.64,26.04 75.56,26.04 72.39,29.21 v71.75,29.21 | U13.16 63.13,33.39 v63.5,33.02
AIN_VBAT  (via drill 0.35 pad 0.55)
  Top 0.254: TP5.TP v70.48,38.71
  Bottom 0.254: R75.2 R73.2 69.24,37.47 | U13.14 59.62,34.85 60.33,35.56 66.04,35.56 67.94,37.47 69.24,37.47 | v70.48,38.71 69.24,37.47
AIN_VIN  (via drill 0.3)
  Top 0.254: v99.06,21.84 99.06,22.86 99.69,23.5 TP8.TP
  Bottom 0.254: R76.2 R74.2 84.77,29.53 86.36,27.94 89.53,27.94 90.81,26.67 96.52,26.67 97.16,26.04 98.42,26.04 99.06,25.4 U15.13 v99.06,21.84
CC_VAL
  Bottom 0.254: U4.2 C7.1 R11.2 93.03,39.05 92.71,38.73 92.71,35.56 93.98,34.29 93.98,30.48 92.71,29.21 VR1.2
CHG_B_CTRL  (via drill 0.3, 0.3 pad 0.55)
  Top 0.254: v123.19,19.05 123.19,26.67 120.65,29.21 v120.65,32.38 | v58.42,29.21 62.23,29.21 63.5,27.94 69.22,27.94 69.85,27.3 69.85,24.13 70.48,23.5 85.09,23.5 85.72,22.86 93.98,22.86 94.61,22.23 94.61,19.68 95.25,19.05 106.05,19.05 107.95,17.14 v111.12,17.14
  Bottom 0.254: v123.19,19.05 121.28,19.05 118.75,16.51 111.76,16.51 v111.12,17.14 | U13.22 60.89,28.01 59.69,29.21 v58.42,29.21 | Q15.1 118.42,39.69 118.11,39.37 118.11,36.83 118.75,36.2 120.02,36.2 120.65,35.56 v120.65,32.38
CHG_B_PROG
  Bottom 0.254: R27.2 111.44,37.15 111.76,37.47 U9.2
CHG_B_STATE  (via drill 0.3)
  Top 0.254: v111.76,46.74 111.76,44.45 112.39,43.81 | 112.39,43.81 113.03,43.18 D17.C 116.95,41.38 117.16,41.17 R81.1 | 112.39,43.81 112.39,37.47 111.76,36.83 v111.76,29.84
  Bottom 0.254: v111.76,46.74 U9.7 | U15.15 101.6,26.04 102.23,26.67 110.49,26.67 111.76,27.94 v111.76,29.84
CHG_B_SW  (via drill 0.35)
  Top 0.406: v116.2,44.45 116.2,46.35 115.57,46.99 R31.1
  Bottom 0.406: R31.1 113.67,45.62 U9.8 | R32.1 117.63,35.41 117.01,36.02 Q15.3 117.01,43.65 v116.2,44.45
CHG_B_VCC
  Bottom 0.406: R31.2 113.67,34.92 113.03,34.29 | 113.03,34.29 112.39,33.66 107.95,33.66 107.31,34.29 C21.1 108.35,37.97 U9.4 | R32.2 113.03,34.29
CHG_DIV1
  Bottom 0.254: VR2.3 104.78,31.11 104.14,31.75 95.89,31.75 95.25,32.38 95.25,34.29 93.98,35.56 R11.1
CHG_DIV2
  Bottom 0.254: VR1.1 88.9,29.21 88.58,29.53 R12.2
CHG_DIV3
  Bottom 0.254: R9.1 95.25,30.48 94.61,29.84 VR1.3
CHG_FB
  Top 0.254: D5.C 88.9,33.66 88.9,36.83 | U7.4 88.06,37.67 88.9,36.83 | R16.1 88.27,43.81 88.9,43.18 88.9,36.83
  Bottom 0.254: R16.1 88.27,43.81 88.9,43.18 88.9,38.1 88.47,37.67 U7.4
CHG_FB_OUT
  Bottom 0.254: U4.1 97.79,37.47 97.47,37.15 C7.2 96.52,34.29 97.16,33.66 D5.A
CHG_OUT
  Bottom 0.813: U7.2 76.41,41.07 75.56,41.91 L5.1 75.45,42.66 D8.C
CHG_STATE  (via drill 0.3)
  Top 0.254: v91.44,31.75 99.06,31.75 100.33,33.02 R70.2
  Bottom 0.254: U4.7 90.17,35.56 91.44,34.29 v91.44,31.75 90.81,31.11 90.81,27.94 91.44,27.3 97.16,27.3 97.79,26.67 99.06,26.67 100.33,25.4 U15.14
FULL_VAL  (via drill 0.3)
  Top 0.254: VR2.2 102.23,29.84 101.6,30.48 v92.08,30.48
  Bottom 0.254: U4.6 91.44,35.56 92.71,34.29 92.71,31.11 v92.08,30.48
GND  (via drill 0.3, 4 pad 6)
  Top 0.254: D16.C D19.C D22.A D23.A
  other vias: 5,5 5,53.5 75.95,35.94 88.01,35.05 100.46,33.78 93.34,28.57 85.09,20.95 50.42,13.46 118.62,23.24 107.7,23.37 112.39,20.32 135.89,36.83 79.76,47.75 89.53,31.11 94.61,13.72 92.84,16.26 103.63,13.46 74.93,18.41 92.58,18.16 81.28,11.43 102.11,21.72 74.93,10.54 70.1,36.2 18.41,25.4 34.92,25.4 43.81,31.75 40.64,33.66 58.42,45.72 65.41,23.5 63.5,36.2 26.04,12.06 41.27,31.75 83.06,17.65 84.2,37.59 67.94,23.5 82.3,14.1 81.66,14.48 113.67,4.45 112.39,4.45 113.67,5.71 112.39,5.71 120.27,4.45 120.27,5.71 121.54,5.71 121.54,4.45 116.97,20.95 116.97,19.68 86.61,49.91 86.61,47.88 88.65,49.91 88.65,47.88 102.62,36.32 103.89,36.32 101.35,36.32 102.62,42.42 101.35,42.42 103.89,42.42 86.61,39.37 87.63,39.37 134.62,24.13 134.62,22.86 134.62,21.59 92.33,39.88 65.41,47.62 65.41,48.9 65.41,46.35 81.03,14.48 126.36,46.35 126.36,47.62 126.11,32 130.56,32 5.08,21.59 6.35,21.59 5.71,45.72 6.99,45.72 116.2,29.84 116.2,32.38 57.78,12.45 113.67,19.05 107.7,15.24 29.21,25.4 47.37,29.84 56.52,15.88 58.17,19.68 49.53,42.55 54.61,40.64 54.61,39.37 52.07,42.55 57.15,34.92 61.21,30.48 40.01,41.91 41.91,41.91 46.35,42.55 36.83,41.91 29.84,38.1 32.38,39.37 27.3,33.66 27.3,25.4 43.94,26.04 36.2,39.37 34.29,43.05 36.2,31.75 24.77,25.4 21.59,25.4 112.65,35.69 37.47,45.72 40.64,45.72
  pour Top: 0,0 10,0 10,10 0,10
  pour Top: 0,48.5 10,48.5 10,58.5 0,58.5
  pour Top: 112,0 122,0 122,9 112,9
  pour Bottom: 0,48.5 10,48.5 10,58.5 0,58.5
  pour Bottom: 0,0 10,0 10,10 0,10
  pour Bottom: 112,0 122,0 122,8.37 112,8.37
  pour Top (rank 2): 0,0 143.5,0 143.5,58.5 0,58.5
  pour Bottom: 0,0 143.5,0 143.5,58.5 0,58.5
HDD5_CTRL  (via drill 0.3)
  Top 0.254: U12.9 34.92,40.01 35.56,40.64 49.53,40.64 50.16,40.01 50.16,36.83 50.8,36.2 53.98,36.2 54.61,35.56 v54.61,34.92
  Bottom 0.254: U13.9 54.88,33.39 54.61,33.66 v54.61,34.92
HDD5_EN  (via drill 0.3)
  Top 0.254: U10.3 78.11,21.59 77.47,22.23 73.66,22.23 73.02,21.58 v73.02,19.06 | v50.8,22.86 50.8,20.95 | 50.8,20.95 50.8,18.41 52.07,17.14 v53.98,17.14 | U12.1 v28.57,27.94 27.94,27.94 27.3,28.57 27.3,31.11 27.94,31.75 33.66,31.75 34.29,32.38 | TP16.TP 51.44,20.32 50.8,20.95 | 34.29,32.38 34.92,33.02 35.56,33.02 36.2,33.66 U12.8 | 34.29,32.38
  Bottom 0.254: v73.02,19.06 v73.03,19.05 72.39,18.41 62.23,18.41 60.96,17.14 v53.98,17.14 | v28.57,27.94 28.57,24.77 29.21,24.13 43.81,24.13 44.45,23.5 44.45,22.23 45.09,21.59 50.16,21.59 50.8,22.23 v50.8,22.86
HDD12_CTRL  (via drill 0.3)
  Top 0.254: U12.2 29.84,27.94 30.48,27.3 46.99,27.3 v47.62,27.94
  Bottom 0.254: U13.3 47.7,28.01 v47.62,27.94
HDD12_EN  (via drill 0.3)
  Top 0.254: U12.3 v31.11,27.94 | U11.1 59.9,12.7 59.27,13.34 54.61,13.34 49.53,18.41 TP17.TP v49.53,22.86
  Bottom 0.254: v31.11,27.94 31.11,25.4 31.75,24.77 44.45,24.77 45.09,24.13 45.09,22.86 45.72,22.23 48.9,22.23 v49.53,22.86
IBAT_DIVN
  Bottom 0.254: U4.9 U4.8 R59.2
IBAT_DIVP  (via drill 0.3)
  Top 0.254: R52.1 92.39,47.31 92.71,47.62 v92.71,50.8
  Bottom 0.254: U4.10 v92.71,50.8 92.39,51.12 R54.2
IBAT_N
  Bottom 0.254: U4.13 96.52,46.99 96.83,46.67 R67.1 100.64,46.67 100.97,46.35 R63.2
IBAT_P
  Bottom 0.254: R59.1 90.17,53.98 90.81,54.61 95.89,54.61 96.84,53.66 R61.2 96.84,51.12 96.52,50.8 95.89,50.8 95.25,50.16 U4.12
IBUS_N  (via drill 0.3)
  Top 0.254: v20.95,28.57 20.95,29.84 21.91,30.8 R46.1 R45.2
  Bottom 0.254: U16.2 v20.95,28.57
IBUS_P  (via drill 0.3)
  Top 0.254: v19.68,28.57 19.68,29.84 19.36,30.16 R42.1 R44.2
  Bottom 0.254: U16.3 v19.68,28.57
LBAT  (via drill 0.3)
  Top 0.254: PJ4.11 32.5,5.83 33.66,6.99 33.66,13.97 34.29,14.61 46.35,14.61 47.62,15.88 47.62,23.5 48.26,24.13 57.15,24.13 59.05,26.04 v59.05,26.67
  Bottom 0.254: U13.24 59.31,26.41 v59.05,26.67
LED1_+5
  Top 0.254: D16.A 59.69,18.41 60.33,19.05 68.58,19.05 69.53,18.1 R57.1
LED1_+12  (via drill 0.3)
  Top 0.254: v62.87,16.51 62.23,17.14 D19.A
  Bottom 0.254: R62.1 62.55,16.2 v62.87,16.51
LED1_-9  (via drill 0.3)
  Top 0.254: v65.41,16.51 64.77,17.14 D22.C
  Bottom 0.254: v65.41,16.51 66.04,15.88 69.22,15.88 69.85,15.24 R64.1
LED1_-22  (via drill 0.3)
  Top 0.254: D23.C v67.31,16.53
  Bottom 0.254: R68.1 71.12,15.88 70.46,16.53 v67.31,16.53
LED2_EN
  Top 0.254: JP2.2 120.02,51.44 119.05,50.47 D17.A
LED2_P
  Top 0.254: JP2.1 125.73,53.98 126.36,53.34 126.36,49.53 125.73,48.9 R69.1
LED3_EN
  Top 0.254: JP1.2 108.58,36.83 110.05,38.3 D21.A
LED3_P
  Top 0.254: R70.1 105.41,33.02 106.05,32.38 106.05,29.21 106.68,28.57 JP1.1
LED_CC
  Bottom 0.254: D15.C R43.2
LED_G
  Bottom 0.254: U13.27 59.62,23.57 59.69,23.5 59.69,19.05 59.05,18.41 31.75,18.41 24.13,18.41 23.5,17.78 22.86,17.14 22.86,12.7 22.23,12.06 D15.AX
LED_R
  Bottom 0.254: U13.28 58.82,23.89 58.42,23.5 57.78,23.5 57.15,22.86 57.15,19.68 56.52,19.05 20.95,19.05 19.05,17.14 D15.AR
MAIN_CTRL  (via drill 0.3)
  Top 0.254: U14.10 TP24.TP 44.45,38.73 47.62,38.73 48.26,38.1 48.26,32.38 48.9,31.75 v52.7,31.75
  Bottom 0.254: U13.7 53.24,31.21 v52.7,31.75
MAIN_EN  (via drill 0.3)
  Top 0.254: U11.7 60.96,4.45 61.59,5.08 61.59,7.62 | U11.5 60.96,6.99 61.59,7.62 | 61.59,10.16 60.96,9.53 U11.3 53.98,9.53 53.34,10.16 53.34,13.34 52.07,14.61 | 61.59,7.62 61.59,10.16 | 61.59,10.16 61.59,10.79 62.23,11.43 63.5,11.43 64.14,12.06 v64.14,16.51 | U10.1 75.56,19.68 74.93,19.05 v74.3,19.05 | U12.10 v33.66,33.02 | v48.26,22.86 48.26,18.41 52.07,14.61 | U14.6 v45.09,31.75 | TP15.TP 52.07,14.61
  Bottom 0.254: v74.3,19.05 73.03,17.78 64.77,17.78 64.14,17.14 v64.14,16.51 | 36.83,29.84 U18.10 36.83,26.04 37.47,25.4 45.09,25.4 45.72,24.77 45.72,23.5 46.35,22.86 v48.26,22.86 | v45.09,31.75 45.09,31.11 44.45,30.48 37.47,30.48 36.83,29.84 | 36.83,29.84 36.83,32.38 36.2,33.02 v33.66,33.02
MAIN_MID
  Top 0.254: U14.4 42.55,31.75 43.81,33.02 45.72,33.02 46.35,33.66 U14.8
MB_FB
  Bottom 0.254: U6.3 47.73,46.25 48.58,45.41 R18.2 R15.1
MB_MID  (via drill 0.3, 0.3 pad 0.55)
  Top 0.254: U10.12 78.11,27.94 76.83,29.21 74.93,29.21 v72.39,26.67 | v67.94,25.4 67.31,26.04 61.59,26.04 60.33,27.3 53.98,27.3 53.34,27.94 48.9,27.94 47.62,26.67 27.94,26.67 26.67,27.94 26.67,31.75 27.3,32.38 29.21,32.38 29.84,33.02 U12.13
  Bottom 0.254: v72.39,26.67 71.12,25.4 v67.94,25.4
MB_SW  (via drill 0.35)
  Top 0.406: v50.16,48.9 50.16,49.53 50.8,50.16 L4.2
  Bottom 0.406: D9.A 50.05,47.42 48.9,48.58 | v50.16,48.9 49.84,48.58 48.9,48.58 | 48.9,48.58 U6.1
MEM_BACKUP  (via drill 0.3)
  Top 0.254: U12.11 v32.38,38.1 33.02,38.1 TP19.TP
  Bottom 0.254: v32.38,38.1 32.38,35.56 33.02,34.92 41.91,34.92 42.23,35.24 R78.1
MEM_CTRL  (via drill 0.3)
  Top 0.254: v31.11,33.02 U12.12 31.11,40.01 32.38,41.27 TP23.TP 50.16,41.27 50.8,40.64 50.8,37.47 51.44,36.83 55.24,36.83 55.88,36.2 v55.88,34.92
  Bottom 0.254: v31.11,33.02 31.11,32.38 31.75,31.75 34.92,31.75 35.56,31.11 U18.9 | U13.10 56.42,34.38 v55.88,34.92
MEM_EN  (via drill 0.3)
  Top 0.254: U12.4 v32.38,27.94
  Bottom 0.254: U18.8 33.76,27.84 33.66,27.94 v32.38,27.94
MEM_MAIN  (via drill 0.35)
  Top 0.254: U12.6 34.92,31.75 35.56,32.38 36.83,32.38 37.47,33.02 37.47,37.47 | 37.47,37.47 TP18.TP | v36.2,38.1 36.83,38.1 37.47,37.47
  Bottom 0.254: R80.1 36.83,36.83 36.2,37.47 v36.2,38.1
MUL_A
  Bottom 0.254: U15.11 96.52,25.4 95.89,26.04 90.17,26.04 88.9,27.3 85.72,27.3 83.82,29.21 78.74,29.21 74.93,33.02 66.04,33.02 64.23,31.21 U13.18
MUL_B
  Bottom 0.254: U15.10 95.25,22.86 94.61,22.23 93.34,22.23 90.81,24.77 88.9,24.77 87.63,26.04 84.45,26.04 82.55,27.94 77.47,27.94 73.66,31.75 67.31,31.75 65.17,29.61 U13.20
MUL_C
  Bottom 0.254: U13.19 64.7,30.41 66.67,32.38 74.3,32.38 78.11,28.57 83.19,28.57 85.09,26.67 88.27,26.67 89.53,25.4 91.44,25.4 92.81,24.03 U15.9
NRST  (via drill 0.3 pad 0.55)
  Top 0.254: J1.4 53.98,22.23 v53.34,22.86
  Bottom 0.254: U13.1 54.24,25.66 53.34,24.77 v53.34,22.86
PRI_CTRL  (via drill 0.3 pad 0.55)
  Top 0.254: U10.11 79.38,25.4 78.74,24.77 71.75,24.77 71.12,25.4 71.12,27.94 70.48,28.57 64.14,28.57 62.87,29.84 v57.78,29.84 57.15,29.84 54.61,32.38 49.53,32.38 48.9,33.02 48.9,38.73 48.26,39.37 41.91,39.37 41.27,38.73 U14.12 TP21.TP
  Bottom 0.254: v57.78,29.84 60.33,29.84 61.36,28.81 U13.21
PRI_FB
  Top 0.254: U1.4 115.3,25.04 114.94,25.4 112.39,25.4 111.76,24.77 R3.2 110.81,23.81 110.49,23.5 110.49,21.59 110.17,21.27 R1.1
PRI_MID
  Top 0.254: U14.1 38.73,32.38 39.37,33.02 41.91,33.02 42.55,33.66 U14.11
PRI_OK  (via drill 0.3, 0.3 pad 0.55)
  Top 0.254: U10.13 76.83,27.94 76.2,28.57 75.56,28.57 v73.03,26.04 | v68.58,24.77 68.58,26.04 67.94,26.67 62.23,26.67 60.96,27.94 54.61,27.94 53.98,28.57 53.34,28.57 | U12.5 33.66,28.57 34.29,27.94 41.91,27.94 | 41.91,27.94 43.81,27.94 44.45,27.94 | 44.45,27.94 46.35,27.94 46.99,28.57 53.34,28.57 | U14.5 43.81,28.57 44.45,27.94 | U14.3 41.27,28.57 41.91,27.94 | TP14.TP 53.98,29.21 53.34,28.57
  Bottom 0.254: v73.03,26.04 71.75,24.77 v68.58,24.77
PRI_OK_CTRL  (via drill 0.3)
  Top 0.254: U14.13 40.01,39.37 40.64,40.01 48.9,40.01 49.53,39.37 49.53,33.66 50.16,33.02 v53.98,33.02 55.88,33.02 TP25.TP
  Bottom 0.254: U13.8 54.24,32.76 v53.98,33.02
PRI_OUT
  Bottom 1.422: U1.2 122.31,20.6 D1.C 124.57,29.1 L1.1
RST_B
  Top 0.254: Q11.1 R39.1
RST_MCU  (via drill 0.3)
  Top 0.254: R39.2 20,13.02 21.59,14.61 33.02,14.61 33.66,15.24 45.72,15.24 46.99,16.51 46.99,24.13 47.62,24.77 56.52,24.77 57.78,26.04 v57.78,26.67
  Bottom 0.254: U13.29 58.02,26.43 v57.78,26.67
RSTIN
  Bottom 0.254: PJ4.4 18.5,6.43 19.05,6.99 25.4,6.99 27.3,8.89 30.48,8.89 31.11,9.53 31.11,15.88 33.02,17.78 60.33,17.78 62.23,19.68 62.23,24.77 61.97,25.03 U13.25
RSTOUT
  Top 0.254: PJ4.5 20.5,5.89 20.95,6.35 Q11.3 22.39,7.79 22.52,7.91 S2.B2
  Bottom 0.254: PJ4.5 20.5,3.63 20.95,3.17 35.56,3.17 36.45,4.06 C25.+
RX  (via drill 0.3)
  Top 0.254: J2.3 17.78,10.16 18.41,10.79 18.41,13.34 20.32,15.24 32.38,15.24 33.02,15.88 45.09,15.88 46.35,17.14 46.35,24.77 46.99,25.4 52.07,25.4 52.38,25.71 R41.1 v55.88,26.67
  Bottom 0.254: PJ4.2 14.5,6.25 15.24,6.99 16.51,6.99 17.78,8.26 J2.3 | v55.88,26.67 56.42,26.13 U13.31
SEC_CTRL  (via drill 0.3)
  Top 0.254: v110.49,15.88 107.95,15.88 105.41,18.41 94.61,18.41 93.98,19.05 93.98,21.59 93.34,22.23 85.09,22.23 84.45,22.86 69.85,22.86 69.22,23.5 69.22,26.67 68.58,27.3 62.87,27.3 61.59,28.57 v59.05,28.57 57.15,28.57 54.61,31.11 48.26,31.11 | U14.9 45.09,37.47 45.72,38.1 46.99,38.1 47.62,37.47 47.62,31.75 48.26,31.11 | 48.26,31.11 48.9,30.48 TP22.TP
  Bottom 0.254: U13.23 60.42,27.21 v59.05,28.57 | R7.1 110.17,15.56 v110.49,15.88
SEC_VIN
  Bottom 0.406: SJ2.2 120.02,26.04 119.38,25.4 113.03,25.4 111.76,24.13 111.76,20.95 110.81,20 R6.2 Q2.2
SEC_VIN_SW  (via drill 0.35)
  Top 0.406: v80.64,3.81 81.92,2.54 R17.1 90.81,2.54 v91.44,3.17 92.08,3.81 v100.33,3.81 101.6,2.54 R10.1 | v129.54,44.45 133.25,44.45 L2.1
  Bottom 0.406: U5.6 99.69,5.71 100.33,5.08 v100.33,3.81 | Q2.3 105.58,19.86 104.01,18.29 C9.+ | C9.+ 104.01,14.1 104.78,13.34 104.78,10.16 104.14,9.53 97.79,9.53 96.52,10.79 92.71,10.79 91.44,9.53 v91.44,3.17 | U8.6 80.01,5.71 80.64,5.08 v80.64,3.81 | 130.18,54.61 U2.5 U2.4 | 130.18,54.61 127.77,54.61 C4.1 | 130.18,54.61 129.54,53.98 v129.54,44.45 129.54,35.56 127.64,33.66 127.64,19.05 126.36,17.78 121.92,17.78 119.38,15.24 111.12,15.24 109.86,13.97 107.95,13.97 107.31,14.61 105.92,14.61 105.28,15.24 C9.+
SECV_B
  Bottom 0.254: R7.2 108.27,17.46 107.64,18.09 Q3.1
SECV_G
  Bottom 0.254: R6.1 Q2.1 107,21.91 106.68,21.59 106.68,19.68 104.94,17.95 Q3.3
SWIM
  Bottom 0.254: U13.26 60.42,24.04 60.96,23.5 J1.2
TX
  Bottom 0.254: R40.2 20,10.47 19.68,10.79 15.88,10.79 15.24,10.16 J2.2 15.24,8.26 13.97,6.99 13.13,6.99 12.5,6.35 PJ4.1
TX_MCU  (via drill 0.3)
  Top 0.254: v45.09,19.68 45.09,17.14 44.45,16.51 v30.48,16.51
  Bottom 0.254: v30.48,16.51 30.48,10.16 29.84,9.53 26.67,9.53 26.04,8.89 R40.1 | U13.30 57.22,24.2 56.52,23.5 55.24,23.5 54.61,22.86 54.61,22.23 54.61,20.32 53.98,19.68 50.16,19.68 v45.09,19.68
U18B
  Bottom 0.254: U16.7 U16.6
V+
  Top 0.254: TP11.TP 39.37,50.16 | U3.8 11.53,50.7 12.7,49.53 D2.C
  Top 1.422: D2.C 20.32,48.9 22.86,51.44 27.94,51.44 31.11,48.26 34.29,48.26 | 34.29,48.26 37.47,48.26 39.37,50.16 39.37,53.34 41.02,54.99 66.29,54.99 68.58,52.7 68.58,35.56 70.48,33.66 85.09,33.66 87,31.75 87,28.57 88.9,26.67 118.11,26.67 120.4,24.38 U1.1 | C3.+ 29.84,43.81 34.29,48.26
  Bottom 0.406: R66.1 30.48,46.35 29.72,45.59 C3.+
  Bottom 0.813: SJ2.1 121.54,25.65 120.4,24.52 U1.1
  Bottom 1.422: Q1.3 13.73,55.64 12.7,54.61 D2.C
V+SENSE
  Bottom 0.254: R72.2 R66.2 35.24,40.33 35.56,40.01 45.09,40.01 45.72,39.37 45.72,36.83 46.35,36.2 57.15,36.2 58.02,35.33 U13.12
VBACKUP  (via drill 0.35)
  Top 0.406: v97.79,21.84 97.79,24.77 97.16,25.4 88.27,25.4 85.09,28.57 84.45,28.57 83.94,29.09 D4.A 83.94,31 82.55,32.38 69.85,32.38 67.31,34.92 67.31,51.44 65.41,53.34 v58.42,53.34 57.15,52.07 57.15,46.35 v56.52,45.72
  Bottom 0.406: v58.42,53.34 87,53.34 89.53,55.88 96.52,55.88 98.98,53.42 114.3,53.42 | 114.3,53.42 PJ3.1 116,49.96 114.94,48.9 113.67,48.9 112.39,47.62 109.86,47.62 109.22,46.99 | C22.1 108.08,45.85 109.22,46.99 | U9.5 109.22,46.99 | v97.79,21.84 U15.12 | R82.2 113.34,54.38 114.3,53.42 | v56.52,45.72 55.24,44.45 55.24,43.18 53.34,41.27 53.34,38.73 52.39,37.78 R77.2 47.3,37.78 46.67,38.41 Q12.2
VBACKUP_SW  (via drill 0.35)
  Top 0.406: L4.1 43.18,50.06 v43.18,45.72
  Bottom 0.406: U6.5 U6.4 44.98,46.25 44.45,45.72 v43.18,45.72 | C12.1 42.67,46.23 v43.18,45.72 | v43.18,45.72 43.18,43.18 44.45,41.91 45.72,41.91 46.52,41.1 Q12.3
VBACKUP_SW_B
  Bottom 0.254: R78.2 Q13.1
VBACKUP_SW_G
  Bottom 0.254: Q13.3 45.26,41.1 46.35,40.01 48.26,40.01 | Q12.1 48.58,39.69 48.26,40.01 | 48.26,40.01 49.53,40.01 49.85,39.69 R77.1
VBAT+
  Top 0.406: 74.93,45.72 85.72,45.72 86.67,46.67 R16.2
  Top 0.813: 72.39,44.45 73.66,45.72 74.93,45.72 75.56,46.35 75.56,54.61 | 72.39,44.45 72.39,40.64 73.03,40.01 74.93,40.01 75.69,39.24 C16.+ | C17.1 72.39,44.45
  Top 1.422: L5.2 75.56,54.61 76.83,53.34 F1.1
  Bottom 0.406: R73.1 C16.+
  Bottom 1.422: L5.2 30.48,55.24 28.57,53.34 Q1.2
VBAT-  (via drill 0.35)
  Top 0.406: v95.89,46.35 96.52,46.99 96.52,48.26 97.16,48.9 R19.2
  Top 1.422: PJ2.2 105.78,48.9 R19.2
  Bottom 0.406: R61.1 101.6,52.07 102.87,50.8 R19.2 | v95.89,46.35 94.61,46.35 92.71,44.45 U4.5 92.71,41.27 93.34,40.64 94.61,40.64 95.25,41.27 U4.3
VBAT_RAW
  Top 1.422: F1.2 109.86,53.34 111,52.2 PJ2.1
VBTEMP
  Bottom 0.254: PJ3.3 120.02,53.41 120.02,52.07 119.76,51.82 SJ1.1 119.76,46.74 119.38,46.35 115.57,46.35 114.94,45.72 114.94,39.37 114.3,38.73 113.13,38.73 U9.1
VBUS
  Bottom 1.778: PJ1.PWR 13.7,39.1 14.61,40.01 F2.1
VCAP
  Bottom 0.254: U13.5 52.94,29.61 52.7,29.84 C23.1
VCCINT  (via drill 0.3)
  Top 0.254: 29.84,53.34 20.95,53.34 19.05,51.44 U3.1 | 31.11,52.07 29.84,53.34 | 31.11,52.07 v32.38,50.8 | C8.1 31.11,52.07 | v106.05,35.56 106.05,44.45 105.41,45.09 95.89,45.09 95.25,45.72 R52.2 94.3,50.48 93.34,51.44 80.39,51.44 79.76,50.8 v79.76,50.16 | U14.2 v40.01,31.75 | 29.84,53.34 TP10.TP | v50.8,52.7 50.8,51.44 50.16,50.8 v46.38,50.8
  Bottom 0.254: U4.4 93.98,44.45 94.61,45.09 98.42,45.09 99.06,44.45 | 99.06,44.45 99.06,36.2 99.69,35.56 v106.05,35.56 106.05,28.57 105.41,27.94 99.06,27.94 98.11,28.89 R9.2 | 99.06,44.45 99.69,43.81 C18.1 | C26.1 22.55,34.6 22.23,34.92 U16.8 22.23,38.1 22.86,38.73 24.13,38.73 | 71.12,50.8 58.42,50.8 57.15,49.53 53.34,49.53 52.7,50.16 52.7,52.07 52.07,52.7 v50.8,52.7 | 71.12,50.8 72.39,49.53 72.39,40.64 73.03,40.01 80.01,40.01 80.64,39.37 80.64,36.31 80.01,35.68 D6.A | 71.12,50.8 79.12,50.8 v79.76,50.16 | 24.13,38.73 24.77,39.37 24.77,45.72 26.04,46.99 28.57,46.99 v32.38,50.8 33.66,52.07 41.91,52.07 43.18,50.8 v46.38,50.8 | v40.01,31.75 38.1,31.75 37.47,32.38 37.47,33.02 36.83,33.66 28.57,33.66 27.3,34.92 27.3,38.1 26.67,38.73 24.13,38.73
VCCIO  (via drill 0.3, 0.3 pad 0.55)
  Top 0.254: 82.55,28.57 80.64,28.57 79.89,29.33 D4.C 78.74,30.48 v78.11,31.11 77.47,31.11 76.2,29.84 74.3,29.84 v72.39,27.94 71.75,27.3 71.75,26.04 72.39,25.4 74.3,25.4 75.46,26.57 U10.14 | 82.55,28.57 83.19,28.57 84.45,27.3 85.09,27.3 87.63,24.77 95.89,24.77 96.52,24.13 96.52,21.59 97.16,20.95 105.41,20.95 106.05,21.59 TP9.TP 106.05,24.77 105.41,25.4 v104.14,25.4 | v64.77,36.83 60.33,36.83 59.38,35.88 C24.1 58.17,31.75 v57.78,31.37 | U12.14 v28.57,38.1 | v38.73,34.29 U14.14 | R41.2 v48.9,26.67 | U10.9 81.92,27.94 82.55,28.57
  Bottom 0.254: D6.C 78.22,31 v78.11,31.11 77.47,31.75 77.47,38.1 76.83,38.73 71.75,38.73 71.12,39.37 69.85,39.37 68.58,38.1 67.31,38.1 66.04,36.83 v64.77,36.83 | U17.8 79.31,19.68 | 79.31,19.68 79.31,24.19 78.11,25.4 74.93,25.4 v72.39,27.94 | 79.31,19.68 79,20 C27.1 72.7,20 71.75,19.05 64.14,19.05 63.5,19.68 J1.1 | v57.78,31.37 56.13,31.37 55.17,30.41 U13.6 52.77,30.41 52.07,31.11 46.99,31.11 46.35,31.75 | 46.35,31.75 46.35,33.66 45.72,34.29 v38.73,34.29 29.21,34.29 27.94,35.56 27.94,37.47 v28.57,38.1 | 46.35,31.75 46.35,28.57 | U18.14 45.62,27.84 46.35,28.57 | v48.9,26.67 46.99,26.67 46.35,27.3 46.35,28.57 | U15.16 102.97,24.13 103.5,24.13 104.14,24.77 v104.14,25.4
VIN
  Top 0.254: R45.1 23.81,37.15 R8.2
  Top 1.778: R8.2 23.5,42.55 23.5,46.99 D2.A
  Bottom 0.254: Q1.1 16.01,49.4 16.51,48.9 23.5,48.9 | 23.5,48.9 D2.A | R74.1 82.87,32.38 82.23,33.02 78.74,33.02 78.11,33.66 78.11,38.73 77.47,39.37 72.39,39.37 71.75,40.01 71.75,48.9 70.48,50.16 59.05,50.16 57.78,48.9 52.7,48.9 52.07,49.53 52.07,51.44 51.44,52.07 D18.A | R2.2 22.86,48.26 23.5,48.9
  Bottom 0.813: D2.A 28.57,48.9 33.02,53.34 42.55,53.34 43.81,52.07 D18.A
VINCHG
  Bottom 0.813: U7.1 84.31,49.67 82.04,51.94 C15.+ 55.9,51.94 D18.C
VINH
  Top 0.254: R44.1 17.46,39.05 16.51,40.01 R8.1
  Bottom 1.778: F2.2 R8.1

## Text on the board
tPlace: Toshiba T1200 PSU / v1.0 | - | + | + | - | T | Backup / Battery | Main / Battery | Chrg | Chrg | https://github.com/kuba2k2/T1200 | TS-01 | RST | GND | SWIM | VCC | 2022-03 | PJ4 | TX | RX | GND | Reset In | Reset Out | +5V Mem. | GND | +12V I/O | -9V | -9V I/O | GND | Low Bat. | -22V | JLCJLCJLCJLC | +5 | +12 | -9 | -22 | 1 | 2 | 3 | 4 | 5 | 6 | 7 | 8 | 9 | 10 | 11 | 12 | +5V HDD | +5V HDC | +12V HDD | GND | +5V Logic | GND | GND | TX | RX | 1 | 2 | 3 | 4 | 1 | 2 | TX | RX | GND | Rst | Rst | Mem. | GND | +12 | -9 | GND | LBat | -22
bPlace: Toshiba T1200 PSU / v1.0 | Disable / Temp. | © kuba2k2 | Vsec / Source | +5V | V+ | https://github.com/kuba2k2/T1200
tNames: Charging Current | Finished Current
Document: <=0.1A = 0.254, via size 0.25 / auto / <=1.2A = 0.4064, via size 0.35 / auto / 2A = 0.8128, via size 0.8 / 1.5 / 2.5A = 1.27 / 3A = 1.4224 / 3.5A = 1.778